# Altium project 水下去机器人控制板2020.PrjPcb
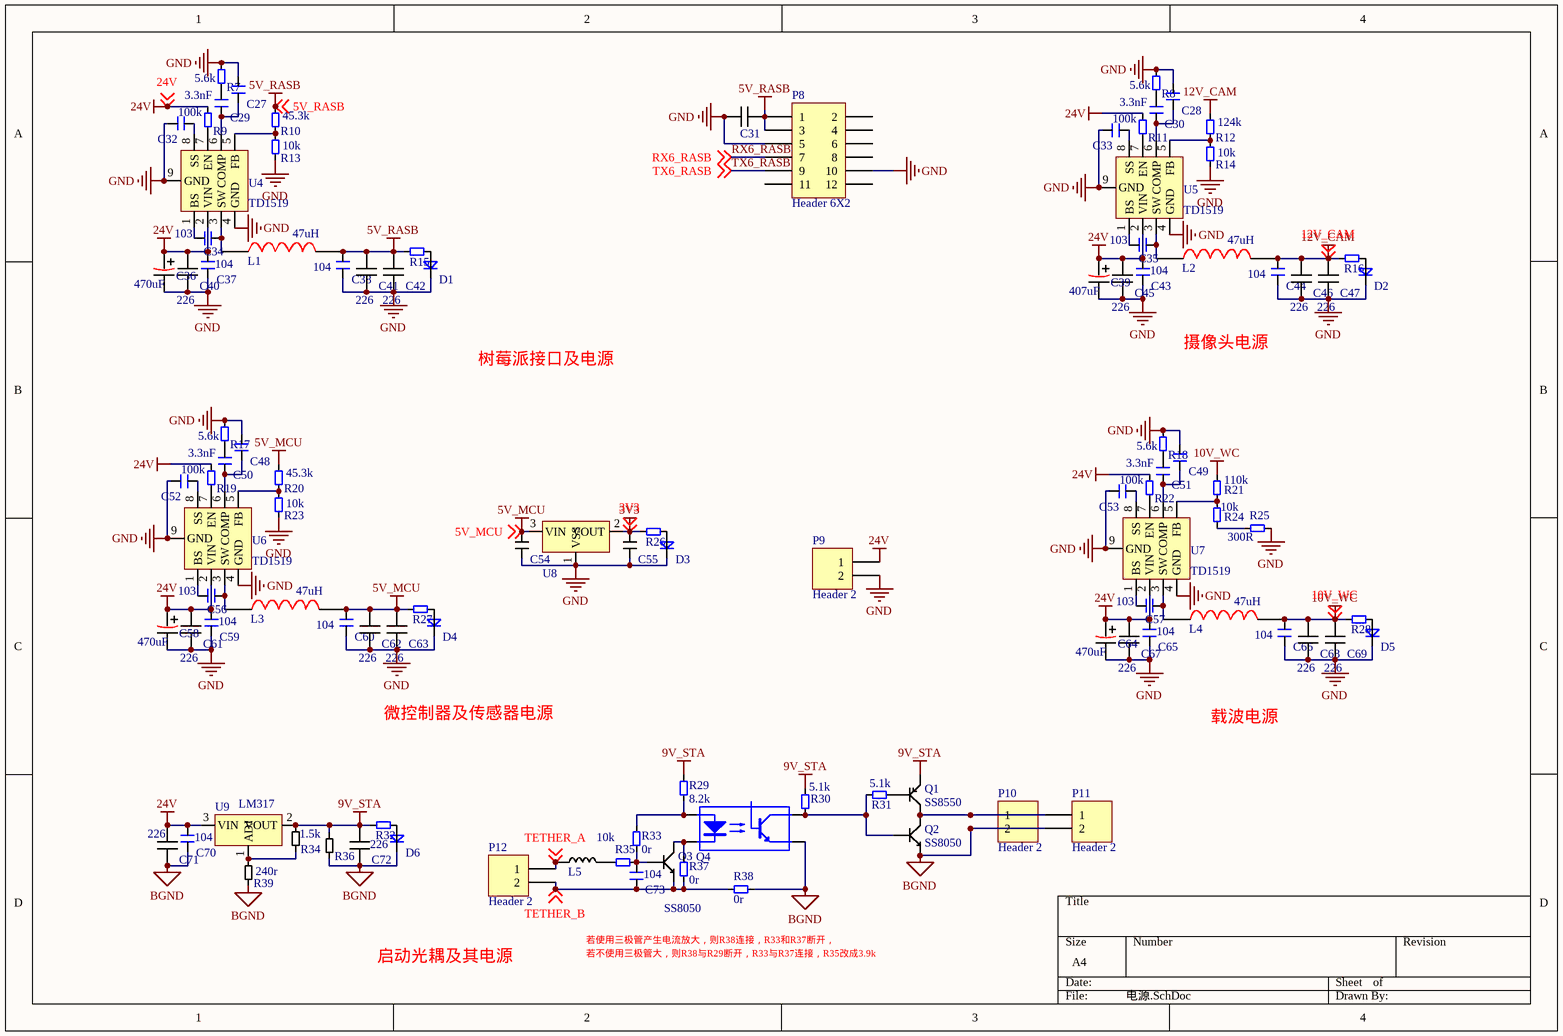
[diagram p0: 电源.SchDoc]
2 sheets, 156 parts. Net scope: global (net labels, ports and power ports of the same name join across sheets).
Board file: 水下去机器人控制板2020.PcbDoc
Sheets:
  电源.SchDoc
  主控.SchDoc

## Sheet 电源.SchDoc
size A4

### Parts
C27  0603C  [0603C]  (value not drawn)
C28  0603C  [0603C]  (value not drawn)
C29  Parameter 1: 3.3nF  [0603C]  (hidden comment: 0603C)
C30  Parameter 1: 3.3nF  [0603C]  (hidden comment: 0603C)
C31  1206C  [固态电容5*9]  (value not drawn)
C32  0603C  [0603C]  (value not drawn)
C33  0603C  [0603C]  (value not drawn)
C34  Parameter 1: 103  [0603C]  (hidden comment: 0603C)
C35  Parameter 1: 103  [0603C]  (hidden comment: 0603C)
C36  Parameter 1: 470uF  [CAP-10*10.2]  (hidden comment: 10*10贴片电解电容)
C37  Parameter 1: 104  [0603C]  (hidden comment: 0603C)
C38  Parameter 1: 104  [0603C]  (hidden comment: 0603C)
C39  Parameter 1: 407uF  [CAP-10*10.2]  (hidden comment: 10*10贴片电解电容)
C40  Parameter 1: 226  [1206C]  (hidden comment: 1206C)
C41  Parameter 1: 226  [1206C]  (hidden comment: 1206C)
C42  Parameter 1: 226  [1206C]  (hidden comment: 1206C)
C43  Parameter 1: 104  [0603C]  (hidden comment: 0603C)
C44  Parameter 1: 104  [0603C]  (hidden comment: 0603C)
C45  Parameter 1: 226  [1206C]  (hidden comment: 1206C)
C46  Parameter 1: 226  [1206C]  (hidden comment: 1206C)
C47  Parameter 1: 226  [1206C]  (hidden comment: 1206C)
C48  0603C  [0603C]  (value not drawn)
C49  0603C  [0603C]  (value not drawn)
C50  Parameter 1: 3.3nF  [0603C]  (hidden comment: 0603C)
C51  Parameter 1: 3.3nF  [0603C]  (hidden comment: 0603C)
C52  0603C  [0603C]  (value not drawn)
C53  0603C  [0603C]  (value not drawn)
C54  0805C  [0805C]  (value not drawn)
C55  0805C  [0805C]  (value not drawn)
C56  Parameter 1: 103  [0603C]  (hidden comment: 0603C)
C57  Parameter 1: 103  [0603C]  (hidden comment: 0603C)
C58  Parameter 1: 470uF  [CAP-10*10.2]  (hidden comment: 10*10贴片电解电容)
C59  Parameter 1: 104  [0603C]  (hidden comment: 0603C)
C60  Parameter 1: 104  [0603C]  (hidden comment: 0603C)
C61  Parameter 1: 226  [1206C]  (hidden comment: 1206C)
C62  Parameter 1: 226  [1206C]  (hidden comment: 1206C)
C63  Parameter 1: 226  [1206C]  (hidden comment: 1206C)
C64  Parameter 1: 470uF  [CAP-10*10.2]  (hidden comment: 10*10贴片电解电容)
C65  Parameter 1: 104  [0603C]  (hidden comment: 0603C)
C66  Parameter 1: 104  [0603C]  (hidden comment: 0603C)
C67  Parameter 1: 226  [1206C]  (hidden comment: 1206C)
C68  Parameter 1: 226  [1206C]  (hidden comment: 1206C)
C69  Parameter 1: 226  [1206C]  (hidden comment: 1206C)
C70  Parameter 1: 104  [0603C]  (hidden comment: 0603C)
C71  Parameter 1: 226  [1206C]  (hidden comment: 1206C)
C72  Parameter 1: 226  [1206C]  (hidden comment: 1206C)
C73  Parameter 1: 104  [0603C]  (hidden comment: 0603C)
D1  0603D  [0603D]  (value not drawn)
D2  0603D  [0603D]  (value not drawn)
D3  0603D  [0603D]  (value not drawn)
D4  0603D  [0603D]  (value not drawn)
D5  0603D  [0603D]  (value not drawn)
D6  0603D  [0603D]  (value not drawn)
L1  Parameter 1: 47uH  [1265L]  (hidden comment: 1265L)
L2  Parameter 1: 47uH  [1265L]  (hidden comment: 1265L)
L3  Parameter 1: 47uH  [1265L]  (hidden comment: 1265L)
L4  Parameter 1: 47uH  [1265L]  (hidden comment: 1265L)
L5  0805L  [0805L]  (value not drawn)
P8  Header 6X2  [HDR2X6]
P9  Header 2  [DB129]
P10  Header 2  [HDR1X2]
P11  Header 2  [HDR1X2]
P12  Header 2  [DB129]
Q1  SS8550  [SOT23-3]
Q2  SS8050  [SOT23-3]
Q3  SS8050  [SOT23-3]
Q4  光耦  [DIP4]  (value not drawn)
R7  Parameter 1: 5.6k  [0603R]  (hidden comment: 0603R)
R8  Parameter 1: 5.6k  [0603R]  (hidden comment: 0603R)
R9  Parameter 1: 100k  [0603R]  (hidden comment: 0603R)
R10  Parameter 1: 45.3k  [0603R]  (hidden comment: 0603R)
R11  Parameter 1: 100k  [0603R]  (hidden comment: 0603R)
R12  Parameter 1: 124k  [0603R]  (hidden comment: 0603R)
R13  Parameter 1: 10k  [0603R]  (hidden comment: 0603R)
R14  Parameter 1: 10k  [0603R]  (hidden comment: 0603R)
R15  0603R  [0603R]  (value not drawn)
R16  0603R  [0603R]  (value not drawn)
R17  Parameter 1: 5.6k  [0603R]  (hidden comment: 0603R)
R18  Parameter 1: 5.6k  [0603R]  (hidden comment: 0603R)
R19  Parameter 1: 100k  [0603R]  (hidden comment: 0603R)
R20  Parameter 1: 45.3k  [0603R]  (hidden comment: 0603R)
R21  Parameter 1: 110k  [0603R]  (hidden comment: 0603R)
R22  Parameter 1: 100k  [0603R]  (hidden comment: 0603R)
R23  Parameter 1: 10k  [0603R]  (hidden comment: 0603R)
R24  Parameter 1: 10k  [0603R]  (hidden comment: 0603R)
R25  Parameter 1: 300R  [0603R]  (hidden comment: 0603R)
R26  0603R  [0603R]  (value not drawn)
R27  0603R  [0603R]  (value not drawn)
R28  0603R  [0603R]  (value not drawn)
R29  Parameter 1: 8.2k  [0603R]  (hidden comment: 0603R)
R30  Parameter 1: 5.1k  [0603R]  (hidden comment: 0603R)
R31  Parameter 1: 5.1k  [0603R]  (hidden comment: 0603R)
R32  0603R  [0603R]  (value not drawn)
R33  Parameter 1: 0r  [0603R]  (hidden comment: 0603R)
R34  Parameter 1: 1.5k  [0805R]  (hidden comment: 0805R)
R35  Parameter 1: 10k  [0603R]  (hidden comment: 0603R)
R36  0805R  [0805R]  (value not drawn)
R37  Parameter 1: 0r  [0603R]  (hidden comment: 0603R)
R38  Parameter 1: 0r  [0603R]  (hidden comment: 0603R)
R39  Parameter 1: 240r  [0805R]  (hidden comment: 0805R)
U4  TD1519  [SOP8-PAD]
U5  TD1519  [SOP8-PAD]
U6  TD1519  [SOP8-PAD]
U7  TD1519  [SOP8-PAD]
U8  662k  [SOT23-3]  (value not drawn)
U9  LM317  [TO252-3]

### Nets
3V3: C55.2 R26.1 U8.2(VOUT) ; off-sheet 3V3
5V_MCU: C54.2 C60.2 C62.1 C63.1 L3.2 R20.2 R27.1 U8.3(VIN) ; off-sheet 5V_MCU
5V_RASB: C31.2 C38.2 C41.1 C42.1 L1.2 P8.1 P8.3 R10.2 R15.1 ; off-sheet 5V_RASB
9V_STA: C72.1 Q1.2(E) R29.1 R30.1 R32.1 R34.2 R36.2 U9.2(VOUT)
10V_WC: C66.2 C68.1 C69.1 L4.2 R21.2 R28.1 ; off-sheet 10V_WC
12V_CAM: C44.2 C46.1 C47.1 L2.2 R12.2 R16.1 ; off-sheet 12V_CAM
24V: C36.1 C37.2 C39.1 C40.1 C43.2 C45.1 C58.1 C59.2 C61.1 C64.1 C65.2 C67.1 C70.2 C71.1 P9.1 R9.2 R11.2 R19.2 R22.2 U4.2(VIN) U5.2(VIN) U6.2(VIN) U7.2(VIN) U9.3(VIN) ; off-sheet 24V
BGND: C70.1 C71.2 C72.2 D6.2 P10.2 P11.2 Q2.2(E) Q4.3(Emitter) R36.1 R38.2 R39.1
GND: C27.1 C28.1 C31.1 C32.2 C33.2 C36.2 C37.1 C38.1 C39.2 C40.2 C41.2 C42.2 C43.1 C44.1 C45.2 C46.2 C47.2 C48.1 C49.1 C52.2 C53.2 C54.1 C55.1 C58.2 C59.1 C60.1 C61.2 C62.2 C63.2 C64.2 C65.1 C66.1 C67.2 C68.2 C69.2 D1.2 D2.2 D3.2 D4.2 D5.2 P8.5 P8.10 P9.2 R7.2 R8.2 R13.1 R14.1 R17.2 R18.2 R23.1 R25.1 U4.4(GND) U4.9(GND) U5.4(GND) U5.9(GND) U6.4(GND) U6.9(GND) U7.4(GND) U7.9(GND) U8.1(VSS)
RX6_RASB: P8.7 ; off-sheet RX6_RASB
TETHER_A: L5.1 P12.1 ; off-sheet TETHER_A
TETHER_B: C73.1 P12.2 Q3.2(E) R37.1 R38.1 ; off-sheet TETHER_B
TX6_RASB: P8.9 ; off-sheet TX6_RASB
NetC27_2: C27.2 C29.2 U4.6(COMP)
NetC28_2: C28.2 C30.2 U5.6(COMP)
NetC29_1: C29.1 R7.1
NetC30_1: C30.1 R8.1
NetC32_1: C32.1 U4.8(SS)
NetC33_1: C33.1 U5.8(SS)
NetC34_1: C34.1 L1.1 U4.3(SW)
NetC34_2: C34.2 U4.1(BS)
NetC35_1: C35.1 L2.1 U5.3(SW)
NetC35_2: C35.2 U5.1(BS)
NetC48_2: C48.2 C50.2 U6.6(COMP)
NetC49_2: C49.2 C51.2 U7.6(COMP)
NetC50_1: C50.1 R17.1
NetC51_1: C51.1 R18.1
NetC52_1: C52.1 U6.8(SS)
NetC53_1: C53.1 U7.8(SS)
NetC56_1: C56.1 L3.1 U6.3(SW)
NetC56_2: C56.2 U6.1(BS)
NetC57_1: C57.1 L4.1 U7.3(SW)
NetC57_2: C57.2 U7.1(BS)
NetC73_2: C73.2 Q3.1(B) R33.1 R35.1
NetD1_1: D1.1 R15.2
NetD2_1: D2.1 R16.2
NetD3_1: D3.1 R26.2
NetD4_1: D4.1 R27.2
NetD5_1: D5.1 R28.2
NetD6_1: D6.1 R32.2
NetL5_2: L5.2 R35.2
NetP10_1: P10.1 P11.1 Q1.3(C) Q2.3(C)
NetQ1_1: Q1.1(B) R31.2
NetQ2_1: Q2.1(B) Q4.4(Collector) R30.2 R31.1
NetQ3_3: Q3.3(C) Q4.2(LED_Cathode) R37.2
NetQ4_1: Q4.1(LED_Anode) R29.2 R33.2
NetR9_1: R9.1 U4.7(EN)
NetR10_1: R10.1 R13.2 U4.5(FB)
NetR11_1: R11.1 U5.7(EN)
NetR12_1: R12.1 R14.2 U5.5(FB)
NetR19_1: R19.1 U6.7(EN)
NetR20_1: R20.1 R23.2 U6.5(FB)
NetR21_1: R21.1 R24.2 U7.5(FB)
NetR22_1: R22.1 U7.7(EN)
NetR24_1: R24.1 R25.2
NetR34_1: R34.1 R39.2 U9.1(ADJ)

Not connected (* = marked no-connect by the designer): P8 2 4 6 8 11 12

### Notes on the sheet
- 树莓派接口及电源
- 摄像头电源
- 微控制器及传感器电源
- 载波电源
- 启动光耦及其电源
- 若使用三极管产生电流放大，则R38连接，R33和R37断开，
- 若不使用三极管大，则R38与R29断开，R33与R37连接，R35改成3.9k

### Library data of the parts
P8 = Header 6X2: Header, 6-Pin, Dual row; LatestRevisionDate: 17-Jul-2002; LatestRevisionNote: Re-released for DXP Platform.; Publisher: Altium Limited
P9-P12 = Header 2: Header, 2-Pin; LatestRevisionDate: 17-Jul-2002; LatestRevisionNote: Re-released for DXP Platform.; Publisher: Altium Limited
Q4 = LTV-8141S

## Sheet 主控.SchDoc
size A4
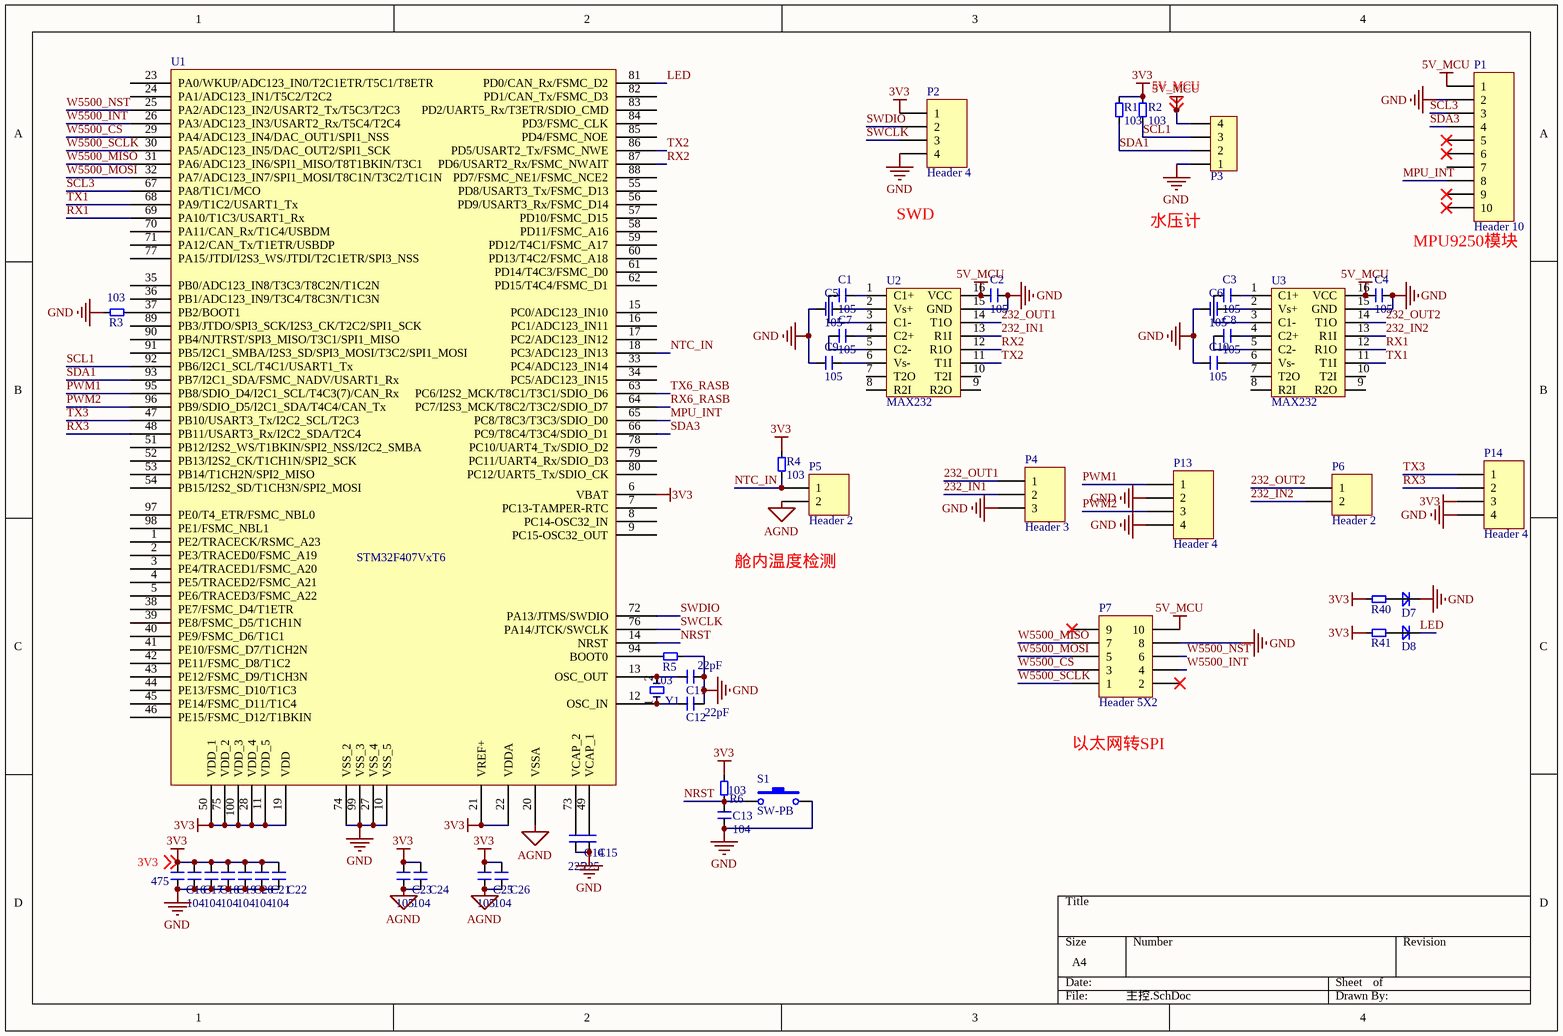
[diagram p1: 主控.SchDoc]

### Parts
C1  Parameter 1: 105  [0603C]  (hidden comment: 0603C)
C2  Parameter 1: 105  [0603C]  (hidden comment: 0603C)
C3  Parameter 1: 105  [0603C]  (hidden comment: 0603C)
C4  Parameter 1: 105  [0603C]  (hidden comment: 0603C)
C5  Parameter 1: 105  [0603C]  (hidden comment: 0603C)
C6  Parameter 1: 105  [0603C]  (hidden comment: 0603C)
C7  Parameter 1: 105  [0603C]  (hidden comment: 0603C)
C8  Parameter 1: 105  [0603C]  (hidden comment: 0603C)
C9  Parameter 1: 105  [0603C]  (hidden comment: 0603C)
C10  Parameter 1: 105  [0603C]  (hidden comment: 0603C)
C11  Parameter 1: 22pF  [0603C]  (hidden comment: 0603C)
C12  Parameter 1: 22pF  [0603C]  (hidden comment: 0603C)
C13  Parameter 1: 104  [0603C]  (hidden comment: 0603C)
C14  Parameter 1: 225  [0603C]  (hidden comment: 0603C)
C15  Parameter 1: 225  [0603C]  (hidden comment: 0603C)
C16  Parameter 1: 475  [0603C]  (hidden comment: 0603C)
C17  Parameter 1: 104  [0603C]  (hidden comment: 0603C)
C18  Parameter 1: 104  [0603C]  (hidden comment: 0603C)
C19  Parameter 1: 104  [0603C]  (hidden comment: 0603C)
C20  Parameter 1: 104  [0603C]  (hidden comment: 0603C)
C21  Parameter 1: 104  [0603C]  (hidden comment: 0603C)
C22  Parameter 1: 104  [0603C]  (hidden comment: 0603C)
C23  Parameter 1: 105  [0603C]  (hidden comment: 0603C)
C24  Parameter 1: 104  [0603C]  (hidden comment: 0603C)
C25  Parameter 1: 105  [0603C]  (hidden comment: 0603C)
C26  Parameter 1: 104  [0603C]  (hidden comment: 0603C)
D7  0603D  [0603D]  (value not drawn)
D8  0603D  [0603D]  (value not drawn)
P1  Header 10  [HDR1X10]
P2  Header 4  [HDR1X4]
P3  1.27mm-4p  [1.27mm-4P]  (value not drawn)
P4  Header 3  [DB129-3]
P5  Header 2  [HDR1X2]
P6  Header 2  [DB129]
P7  Header 5X2  [HDR2X5]
P13  Header 4  [HDR1X4]
P14  Header 4  [HDR1X4]
R1  Parameter 1: 103  [0603R]  (hidden comment: 0603R)
R2  Parameter 1: 103  [0603R]  (hidden comment: 0603R)
R3  Parameter 1: 103  [0603R]  (hidden comment: 0603R)
R4  Parameter 1: 103  [0603R]  (hidden comment: 0603R)
R5  Parameter 1: 103  [0603R]  (hidden comment: 0603R)
R6  Parameter 1: 103  [0603R]  (hidden comment: 0603R)
R40  0603R  [0603R]  (value not drawn)
R41  0603R  [0603R]  (value not drawn)
S1  SW-PB  [按键 3x6]
U1  STM32F407VxT6  [LQFP-100_M]
U2  MAX232  [SOP16]
U3  MAX232  [SOP16]
Y1  XTAL_5032  [XTAL贴片]  (value not drawn)

### Nets
3V3: C16.2 C17.2 C18.2 C19.2 C20.2 C21.2 C22.2 C23.2 C24.2 C25.1 C26.1 P2.1 P14.3 R1.2 R2.2 R4.2 R6.2 R40.1 R41.1 U1.6(VBAT) U1.11(VDD_5) U1.19(VDD) U1.21(VREF+) U1.22(VDDA) U1.28(VDD_4) U1.50(VDD_1) U1.75(VDD_2) U1.100(VDD_3) ; off-sheet 3V3
5V_MCU: C2.1 C4.1 P1.1 P3.4 P7.10 U2.16(VCC) U3.16(VCC) ; off-sheet 5V_MCU
AGND: C23.1 C24.1 C25.2 C26.2 P5.2 U1.20(VSSA)
GND: C2.2 C4.2 C5.1 C6.1 C9.1 C10.1 C11.2 C12.2 C13.1 C14.1 C15.1 C16.1 C17.1 C18.1 C19.1 C20.1 C21.1 C22.1 D7.2 P1.2 P2.4 P3.1 P4.3 P7.8 P13.2 P13.4 P14.4 R3.1 R5.2 S1.2 U1.10(VSS_5) U1.27(VSS_4) U1.74(VSS_2) U1.99(VSS_3) U2.15(GND) U3.15(GND)
232_IN1: P4.2 U2.13(R1I)
232_IN2: P6.2 U3.13(R1I)
232_OUT1: P4.1 U2.14(T1O)
232_OUT2: P6.1 U3.14(T1O)
LED: D8.2 U1.81(PD0/CAN_Rx/FSMC_D2)
MPU_INT: P1.8 U1.65(PC8/T8C3/T3C3/SDIO_D0)
NRST: C13.2 R6.1 S1.1 U1.14(NRST)
NTC_IN: P5.1 R4.1 U1.18(PC3/ADC123_IN13)
PWM1: P13.1 U1.95(PB8/SDIO_D4/I2C1_SCL/T4C3(7)/CAN_Rx)
PWM2: P13.3 U1.96(PB9/SDIO_D5/I2C1_SDA/T4C4/CAN_Tx)
RX1: U1.69(PA10/T1C3/USART1_Rx) U3.12(R1O)
RX2: U1.87(PD6/USART2_Rx/FSMC_NWAIT) U2.12(R1O)
RX3: P14.2 U1.48(PB11/USART3_Rx/I2C2_SDA/T2C4)
RX6_RASB: U1.64(PC7/I2S3_MCK/T8C2/T3C2/SDIO_D7)
SCL1: P3.3 R2.1 U1.92(PB6/I2C1_SCL/T4C1/USART1_Tx)
SCL3: P1.3 U1.67(PA8/T1C1/MCO)
SDA1: P3.2 R1.1 U1.93(PB7/I2C1_SDA/FSMC_NADV/USART1_Rx)
SDA3: P1.4 U1.66(PC9/T8C4/T3C4/SDIO_D1)
SWCLK: P2.3 U1.76(PA14/JTCK/SWCLK)
SWDIO: P2.2 U1.72(PA13/JTMS/SWDIO)
TX1: U1.68(PA9/T1C2/USART1_Tx) U3.11(T1I)
TX2: U1.86(PD5/USART2_Tx/FSMC_NWE) U2.11(T1I)
TX3: P14.1 U1.47(PB10/USART3_Tx/I2C2_SCL/T2C3)
TX6_RASB: U1.63(PC6/I2S2_MCK/T8C1/T3C1/SDIO_D6)
W5500_CS: P7.3 U1.29(PA4/ADC123_IN4/DAC_OUT1/SPI1_NSS)
W5500_INT: P7.4 U1.26(PA3/ADC123_IN3/USART2_Rx/T5C4/T2C4)
W5500_MISO: P7.7 U1.31(PA6/ADC123_IN6/SPI1_MISO/T8T1BKIN/T3C1)
W5500_MOSI: P7.5 U1.32(PA7/ADC123_IN7/SPI1_MOSI/T8C1N/T3C2/T1C1N)
W5500_NST: P7.6 U1.25(PA2/ADC123_IN2/USART2_Tx/T5C3/T2C3)
W5500_SCLK: P7.1 U1.30(PA5/ADC123_IN5/DAC_OUT2/SPI1_SCK)
NetC1_1: C1.1 U2.3(C1-)
NetC1_2: C1.2 U2.1(C1+)
NetC3_1: C3.1 U3.3(C1-)
NetC3_2: C3.2 U3.1(C1+)
NetC5_2: C5.2 U2.2(Vs+)
NetC6_2: C6.2 U3.2(Vs+)
NetC7_1: C7.1 U2.5(C2-)
NetC7_2: C7.2 U2.4(C2+)
NetC8_1: C8.1 U3.5(C2-)
NetC8_2: C8.2 U3.4(C2+)
NetC9_2: C9.2 U2.6(Vs-)
NetC10_2: C10.2 U3.6(Vs-)
NetC11_1: C11.1 U1.13(OSC_OUT) Y1.2
NetC12_1: C12.1 U1.12(OSC_IN) Y1.1
NetC14_2: C14.2 U1.73(VCAP_2)
NetC15_2: C15.2 U1.49(VCAP_1)
NetD7_1: D7.1 R40.2
NetD8_1: D8.1 R41.2
NetR3_2: R3.2 U1.37(PB2/BOOT1)
NetR5_1: R5.1 U1.94(BOOT0)

Not connected (* = marked no-connect by the designer): P1 5* 6* 7 9* 10*; P7 2* 9*; U1 1(PE2/TRACECK/RSMC_A23) 2(PE3/TRACED0/FSMC_A19) 3(PE4/TRACED1/FSMC_A20) 4(PE5/TRACED2/FSMC_A21) 5(PE6/TRACED3/FSMC_A22) 7(PC13-TAMPER-RTC) 8(PC14-OSC32_IN) 9(PC15-OSC32_OUT) 15(PC0/ADC123_IN10) 16(PC1/ADC123_IN11) 17(PC2/ADC123_IN12) 23(PA0/WKUP/ADC123_IN0/T2C1ETR/T5C1/T8ETR) 24(PA1/ADC123_IN1/T5C2/T2C2) 33(PC4/ADC123_IN14) 34(PC5/ADC123_IN15) 35(PB0/ADC123_IN8/T3C3/T8C2N/T1C2N) 36(PB1/ADC123_IN9/T3C4/T8C3N/T1C3N) 38(PE7/FSMC_D4/T1ETR) 39(PE8/FSMC_D5/T1CH1N) 40(PE9/FSMC_D6/T1C1) 41(PE10/FSMC_D7/T1CH2N) 42(PE11/FSMC_D8/T1C2) 43(PE12/FSMC_D9/T1CH3N) 44(PE13/FSMC_D10/T1C3) 45(PE14/FSMC_D11/T1C4) 46(PE15/FSMC_D12/T1BKIN) 51(PB12/I2S2_WS/T1BKIN/SPI2_NSS/I2C2_SMBA) 52(PB13/I2S2_CK/T1CH1N/SPI2_SCK) 53(PB14/T1CH2N/SPI2_MISO) 54(PB15/I2S2_SD/T1CH3N/SPI2_MOSI) 55(PD8/USART3_Tx/FSMC_D13) 56(PD9/USART3_Rx/FSMC_D14) 57(PD10/FSMC_D15) 58(PD11/FSMC_A16) 59(PD12/T4C1/FSMC_A17) 60(PD13/T4C2/FSMC_A18) 61(PD14/T4C3/FSMC_D0) 62(PD15/T4C4/FSMC_D1) 70(PA11/CAN_Rx/T1C4/USBDM) 71(PA12/CAN_Tx/T1ETR/USBDP) 77(PA15/JTDI/I2S3_WS/JTDI/T2C1ETR/SPI3_NSS) 78(PC10/UART4_Tx/SDIO_D2) 79(PC11/UART4_Rx/SDIO_D3) 80(PC12/UART5_Tx/SDIO_CK) 82(PD1/CAN_Tx/FSMC_D3) 83(PD2/UART5_Rx/T3ETR/SDIO_CMD) 84(PD3/FSMC_CLK) 85(PD4/FSMC_NOE) 88(PD7/FSMC_NE1/FSMC_NCE2) 89(PB3/JTDO/SPI3_SCK/I2S3_CK/T2C2/SPI1_SCK) 90(PB4/NJTRST/SPI3_MISO/T3C1/SPI1_MISO) 91(PB5/I2C1_SMBA/I2S3_SD/SPI3_MOSI/T3C2/SPI1_MOSI) 97(PE0/T4_ETR/FSMC_NBL0) 98(PE1/FSMC_NBL1); U2 7(T2O) 8(R2I) 9(R2O) 10(T2I); U3 7(T2O) 8(R2I) 9(R2O) 10(T2I)

### Notes on the sheet
- SWD
- 水压计
- (near P1) MPU9250模块
- 舱内温度检测
- (near P7) 以太网转SPI

### Library data of the parts
P1 = Header 10: Header, 10-Pin; LatestRevisionDate: 17-Jul-2002; LatestRevisionNote: Re-released for DXP Platform.; Publisher: Altium Limited
P2 P13 P14 = Header 4: Header, 4-Pin; LatestRevisionDate: 17-Jul-2002; LatestRevisionNote: Re-released for DXP Platform.; Publisher: Altium Limited
P4 = Header 3: Header, 3-Pin; LatestRevisionDate: 17-Jul-2002; LatestRevisionNote: Re-released for DXP Platform.; Publisher: Altium Limited
P5 P6 = Header 2: Header, 2-Pin; LatestRevisionDate: 17-Jul-2002; LatestRevisionNote: Re-released for DXP Platform.; Publisher: Altium Limited
P7 = Header 5X2: Header, 5-Pin, Dual row; LatestRevisionDate: 17-Jul-2002; LatestRevisionNote: Re-released for DXP Platform.; Publisher: Altium Limited
S1 = SW-PB: Switch; Published: 24-Mar-1999; LatestRevisionDate: 17-Jul-2002; LatestRevisionNote: Re-released for DXP Platform.; PackageReference: SPST-2; Publisher: Altium Limited; PackageDescription: Switch; 2 Leads

## Nets that join several sheets
3V3: 电源 (C55.2 R26.1 U8.2), 主控 (28 pins)
5V_MCU: 电源 (8 pins), 主控 (7 pins)
GND: 电源 (60 pins), 主控 (36 pins)
RX6_RASB: 电源 (P8.7), 主控 (U1.64)
TX6_RASB: 电源 (P8.9), 主控 (U1.63)